# Altium schematic sheet TVC Flight Computer.SchDoc
size A; SheetNumber: 1; SheetTotal: 2
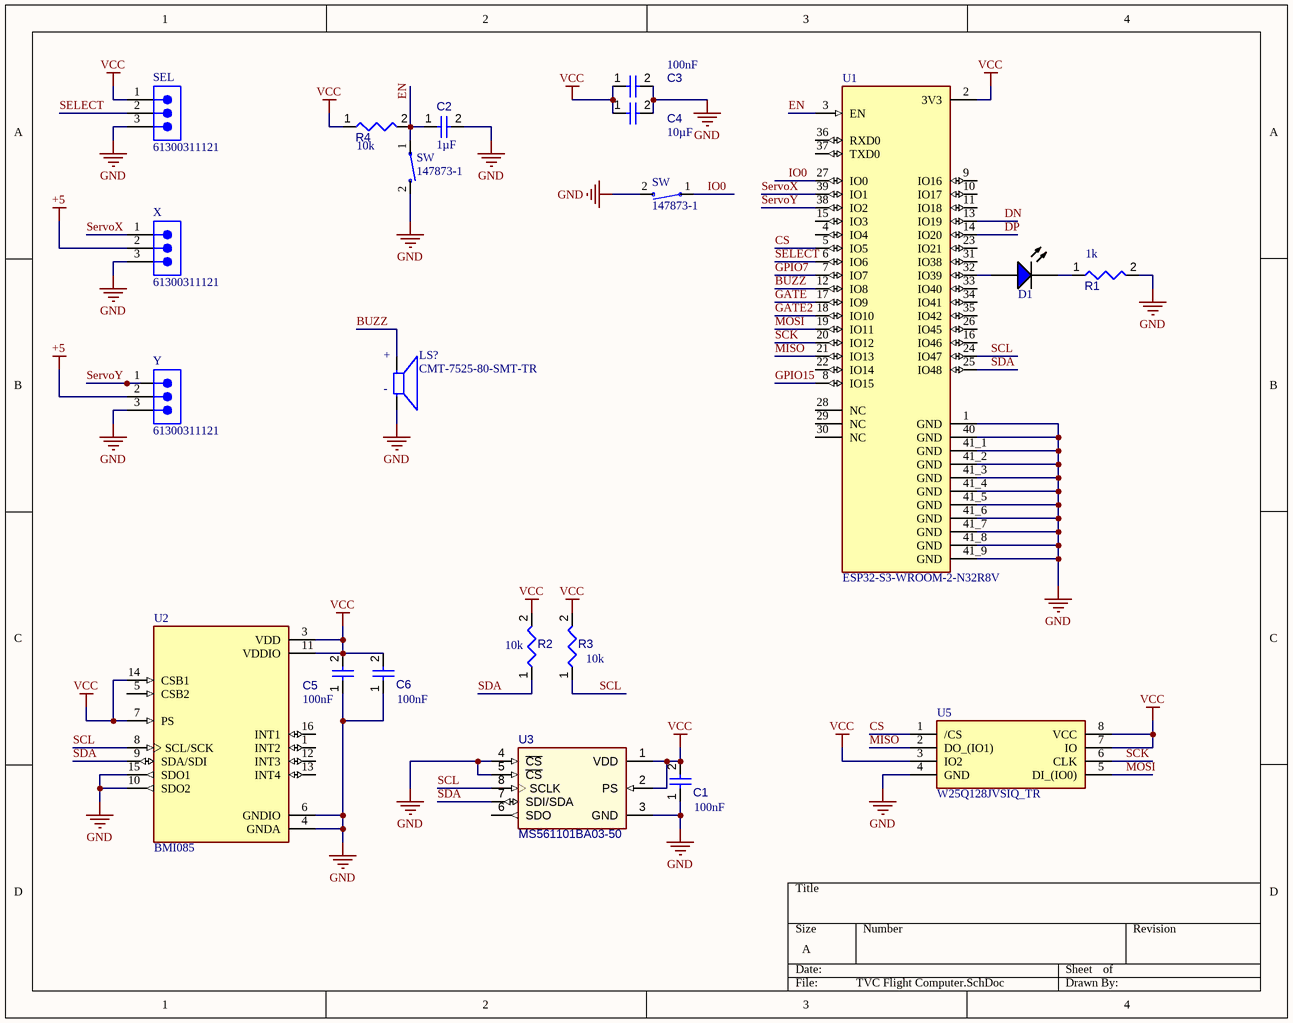
[diagram p0: TVC Flight Computer.SchDoc]

## Parts
(Parts that share a designator on the sheet are numbered #1, #2 ... from top to bottom, then left to right.)
C1  value 100nF  [CAPC1608X90X40NL10T20]  (hidden comment: Capacitor 100 nF +/-10% 50 V 0603)
C2  value 1µF  [CAPC0603(1608)100_L]  (hidden comment: Capacitor 1µF +/-40% 50V 0603)
C3  value 100nF  [CAPC1608X90X40NL10T20]  (hidden comment: Capacitor 100 nF +/-10% 50 V 0603)
C4  value 10µF  [CAPC0603(1608)100_L]  (hidden comment: Capacitor 10µF +/-20% 10V 0603)
C5  value 100nF  [CAPC1608X90X40NL10T20]  (hidden comment: Capacitor 100 nF +/-10% 50 V 0603)
C6  value 100nF  [CAPC1608X90X40NL10T20]  (hidden comment: Capacitor 100 nF +/-10% 50 V 0603)
D1  LTST-C190TBKT  [LTST-C190TBKT-2_V]  (value not drawn)
LS?  CMT-7525-80-SMT-TR  [XDCR_CMT-7525-80-SMT-TR]
R1  value 1k  [RESC1608X55X25ML10T15]  (hidden comment: Resistor 1k +/-1% 0603 100 mW)
R2  value 10k  [RESC1608X55X25ML10T15]  (hidden comment: Resistor 10k +/-1% 0603 100 mW)
R3  value 10k  [RESC1608X55X25ML10T15]  (hidden comment: Resistor 10k +/-1% 0603 100 mW)
R4  value 10k  [RESC1608X55X25ML10T15]  (hidden comment: Resistor 10k +/-1% 0603 100 mW)
SEL  61300311121  [61300311121]
SW#1  147873-1  [SW_147873-1]
SW#2  147873-1  [SW_147873-1]
U1  ESP32-S3-WROOM-2-N32R8V  [XCVR_ESP32-S3-WROOM-2-N32R8V]
U2  BMI085  [PQFN50P450X300X100-16N]
U3  MS561101BA03-50  [TECO-MS561101BA03_V]
U5  W25Q128JVSIQ_TR  [SOIC127P780X195-8N]
X  61300311121  [61300311121]
Y  61300311121  [61300311121]

## Nets
+5: X.2 Y.2
GND: C1.1 C2.2 C3.2 C4.2 C5.1 C6.1 LS?.N R1.2 SEL.3 SW#1.2 SW#2.2 U1.1(GND) U1.40(GND) U1.41_1(GND) U1.41_2(GND) U1.41_3(GND) U1.41_4(GND) U1.41_5(GND) U1.41_6(GND) U1.41_7(GND) U1.41_8(GND) U1.41_9(GND) U2.4(GNDA) U2.6(GNDIO) U2.10(SDO2) U2.15(SDO1) U3.3(GND) U3.4(~{CS}) U3.5(~{CS}) U5.4(GND) X.3 Y.3
VCC: C1.2 C3.1 C4.1 C5.2 C6.2 R2.2 R3.2 R4.1 SEL.1 U1.2(3V3) U2.3(VDD) U2.7(PS) U2.11(VDDIO) U2.14(CSB1) U3.1(VDD) U3.2(PS) U5.3(IO2) U5.7(IO) U5.8(VCC)
BUZZ: LS?.P U1.12(IO8)
CS: U1.5(IO5) U5.1(/CS)
DN: U1.13(IO19)
DP: U1.14(IO20)
EN: C2.1 R4.2 SW#1.1 U1.3(EN)
GATE: U1.17(IO9)
GATE2: U1.18(IO10)
GPIO7: U1.7(IO7)
GPIO15: U1.8(IO15)
IO0: SW#2.1 U1.27(IO0)
MISO: U1.21(IO13) U5.2(DO_(IO1))
MOSI: U1.19(IO11) U5.5(DI_(IO0))
SCK: U1.20(IO12) U5.6(CLK)
SCL: R3.1 U1.24(IO47) U2.8(SCL/SCK) U3.8(SCLK)
SDA: R2.1 U1.25(IO48) U2.9(SDA/SDI) U3.7(SDI/SDA)
SELECT: SEL.2 U1.6(IO6)
ServoX: U1.39(IO1) X.1
ServoY: U1.38(IO2) Y.1
NetD1_1: D1.1(A) U1.32(IO39)
NetD1_2: D1.2(K) R1.1

Not connected (* = marked no-connect by the designer): U1 4(IO4) 9(IO16) 10(IO17) 11(IO18) 15(IO3) 16(IO46) 22(IO14) 23(IO21) 26(IO45) 28(NC) 29(NC) 30(NC) 31(IO38) 33(IO40) 34(IO41) 35(IO42) 36(RXD0) 37(TXD0); U2 1(INT2) 5(CSB2) 12(INT3) 13(INT4) 16(INT1); U3 6(SDO)

## Notes on the sheet
- (in symbol CMP-025-000000-1) +; -

## Library data of the parts
C1 C3 C5 C6 = CMP-001-00017-6: Chip Capacitor, 100 nF, +/- 10%, 50 V, 0603 (1608 Metric); Capacitor Type: Ceramic; Voltage Rating: 50V; Mounting Technology: SM; Case/Package: 0603; Pins: 2; RoHS Compliant: True; Min Operating Temperature: -55°C; Max Operating Temperature: 125°C; Tolerance: 10%
C2 = CMP-001-00078-4: Chip Capacitor, 1µF +/-40%, 50V, 0603, Thickness 1 mm; Tolerance: 10%; Case/Package: 0603; Pins: 2; Max Operating Temperature: 85°C; Voltage Rating: 50V; Mounting Technology: SMT; Min Operating Temperature: -55°C
C4 = CMP-001-00075-4: Chip Capacitor, 10µF +/-20%, 10V, 0603, Thickness 1 mm; Tolerance: 10%; Mounting Technology: SMT; Case/Package: 0603; Pins: 2; Min Operating Temperature: -55°C; Max Operating Temperature: 85°C; Voltage Rating: 10V
D1 = CMP-007-00026-2: LED Uni-Color Blue, 76 mW, 20 mA, -20 to 80 degC, 2-Pin SMD, RoHS, Tape and Reel; Manufacturer: Lite-On; Forward Voltage: 2.8V; Forward Current: 20mA; Nominal Vf: 3.3V; Lens Style: Diffused; Luminous Intensity: 28mcd; Viewing Angle: 130degrees; Mounting Technology: SM; Case/Package: 0603; Pins: 2; RoHS Compliant: True; Min Operating Temperature: -20°C; Max Operating Temperature: 80°C; Colour: Blue; Packaging: TapeandReel; Illumination Colour: Blue; Package Quantity: 3000; Package Reference: C190TBKT-2; Package Description: 2-Pin Surface Mount Device, Body 1.6 x 0.8 mm; Datasheet URL: http://optoelectronics.liteon.com/upload/download/DS-22-99-0224/S_110_LTST-C190TBKT(0630).pdf; Datasheet Version: Rev. K, 08/2011; Manufacturer URL: http://www.us.liteon.com/
LS? = CMP-025-000000-1: 7.5 mm, 3.6 Vo-p, 80 dB, Surface Mount (SMT), Magnetic Audio Transducer Buzzer; MF: CUI Devices; CUI_purchase_URL: https://www.cuidevices.com/product/audio/buzzers/audio-transducers/cmt-7525-80-smt-tr?utm_source=snapeda.com&utm_medium=referral&utm_campaign=snapedaBOM; Package: CUI Devices; MP: CMT-7525-80-SMT-TR; Component Type: Standard; Value: *; Pin Count: 2; Design Item ID: CMT-7525-80-SMT-TR; SnapEDA_Link: https://www.snapeda.com/parts/CMT-7525-80-SMT-TR/CUI+Devices/view-part/?ref=snap; Purchase-URL: https://pricing.snapeda.com/search/part/CMT-7525-80-SMT-TR/?ref=eda; Source: CMT-7525-80-SMT-TR.SchLib; Digi-Key_Part_Number: 102-CMT-7525-80-SMT-TR-ND; Check_prices: https://www.snapeda.com/parts/CMT-7525-80-SMT-TR/CUI+Devices/view-part/?ref=eda
R1 = CMP-009-00014-5: Chip Resistor, 1 KOhm, +/-1%, 0.1 W, -55 to 155 degC, 0603 (1608 Metric); Tolerance: 1%; Power: 100mW; Voltage Rating: 50V; Mounting Technology: SM; Case/Package: 0603; Pins: 2; RoHS Compliant: True; Min Operating Temperature: -55°C; Max Operating Temperature: 155°C
R2-R4 = CMP-009-00017-5: Chip Resistor, 10 KOhm, +/- 1%, 01 W, -55 to 155 degC, 0603 (1608 Metric); Power: 100mW; Voltage Rating: 50V; Mounting Technology: SM; Case/Package: 0603; Pins: 2; RoHS Compliant: True; Min Operating Temperature: -55°C; Max Operating Temperature: 155°C; Tolerance: 1%
SEL X Y = CMP-1502-01062-3: NexarPartId: 32855521; Current Rating: 3A; Voltage Rating: 250V; Number of Positions: 3; Pitch: 2.54mm; Contact Resistance: 20mΩ; Connector Type: Male Pin; Gender: Male; REACH SVHC: Unknown; Packaging: Bulk; Contact Material: Copper; Min Operating Temperature: -40°C; Number of Rows: 1; Orientation: Vertical; RoHS: Compliant; Contact Plating: Gold; Max Operating Temperature: 105°C; Mount: Through Hole; Height: 8.94mm; Operating Supply Voltage: 250V; Number of Pins: 3; Contact Mating Length: 5.9944mm; Number of Contacts: 3; Color: Black; Lead Free: Lead Free; Lead Pitch: 2.54mm; Termination: Solder
SW#1 SW#2 = CMP-011-00013-1: Switch Tactile OFF (ON) SPST Rectangular Button J-Bend 0.05A 24VDC 1.77N SMD T/R; MF: TE Connectivity; Price: None; MP: 147873-1; SnapEDA_Link: https://www.snapeda.com/parts/147873-1/TE%20Connectivity%20ALCOSWITCH%20Switches/view-part/2549694/?ref=snap; Pins: 2; Case/Package: None; Value: *; Availability: Unavailable; Component Type: Standard; Design Item ID: 147873-1; Source: SnapEDAsch.SchLib
U1 = CMP-027-000000-1: Bluetooth, WiFi 802.11b/g/n, Bluetooth v5.0 Transceiver Module 2.4GHz PCB Trace Surface Mount; MF: Espressif Systems; Design Item ID: ESP32-S3-WROOM-2-N32R8V; Package: None; MP: ESP32-S3-WROOM-2-N32R8V; Source: ESP32-S3-WROOM-2-N32R8V.SchLib; SnapEDA_Link: https://www.snapeda.com/parts/ESP32-S3-WROOM-2-N32R8V/Espressif+Systems/view-part/?ref=snap; Pin Count: 49; Check_prices: https://www.snapeda.com/parts/ESP32-S3-WROOM-2-N32R8V/Espressif+Systems/view-part/?ref=eda; Value: *; Component Type: Standard
U2 = CMP-011-000006-1: Accelerometer, Gyroscope, 6 Axis Sensor IÂ²C, SPI Output; MF: Bosch Sensortec; SnapEDA_Link: https://www.snapeda.com/parts/BMI085/Bosch%20Sensortec/view-part/2857155/?ref=snap; Design Item ID: BMI085; Digi-Key_Purchase_URL: https://www.digikey.com/product-detail/en/bosch-sensortec/BMI085/828-1083-1-ND/8634943?utm_source=snapeda&utm_medium=aggregator&utm_campaign=symbol; MP: BMI085; Digi-Key_Part_Number: 828-1083-1-ND; Package: VFLGA-16 Bosch Tools; Source: SnapEDAsch.SchLib; Value: *; Pin Count: 15; Component Type: Standard
U3 = CMP-010-00021-3: Barometric Pressure Sensor, 1.8 to 3.6 V, -40 to 85 degC, 8-Pin SMD, RoHS, Tape and Reel; Min Supply Voltage: 1.8V; Max Supply Voltage: 3.6V; Sensor Type: Barometer; Pins: 8; RoHS Compliant: Yes; Mounting Technology: SMT; Case/Package: LGA-8; Min Operating Temperature: -40°C; Max Operating Temperature: 85°C
U5 = CMP-006-00021-1: FLASH - NOR Memory IC 128Mb (16M x 8) SPI - Quad I/O 8-SOIC; Manufacturer_Name: Winbond; Manufacturer_Part_Number: W25Q128JVSIQ TR; Geometry.Height: 1.95mm; Design Item ID: W25Q128JVSIQ_TR; Mouser Part Number: 454-W25Q128JVSIQTR; Arrow Part Number: W25Q128JVSIQ TR; Source: W25Q128JVSIQ_TR.SchLib; Arrow Price/Stock: https://www.arrow.com/en/products/w25q128jvsiqtr/winbond-electronics?region=nac; Mouser Price/Stock: https://www.mouser.co.uk/ProductDetail/Winbond/W25Q128JVSIQ-TR?qs=qSfuJ%252Bfl%2Fd7vTyLA9kNdGw%3D%3D; Datasheet Link: http://www.winbond.com/resource-files/w25q128jv%20spi%20revc%2011162016.pdf